# EAGLE design 3 (EAGLE 6.4)
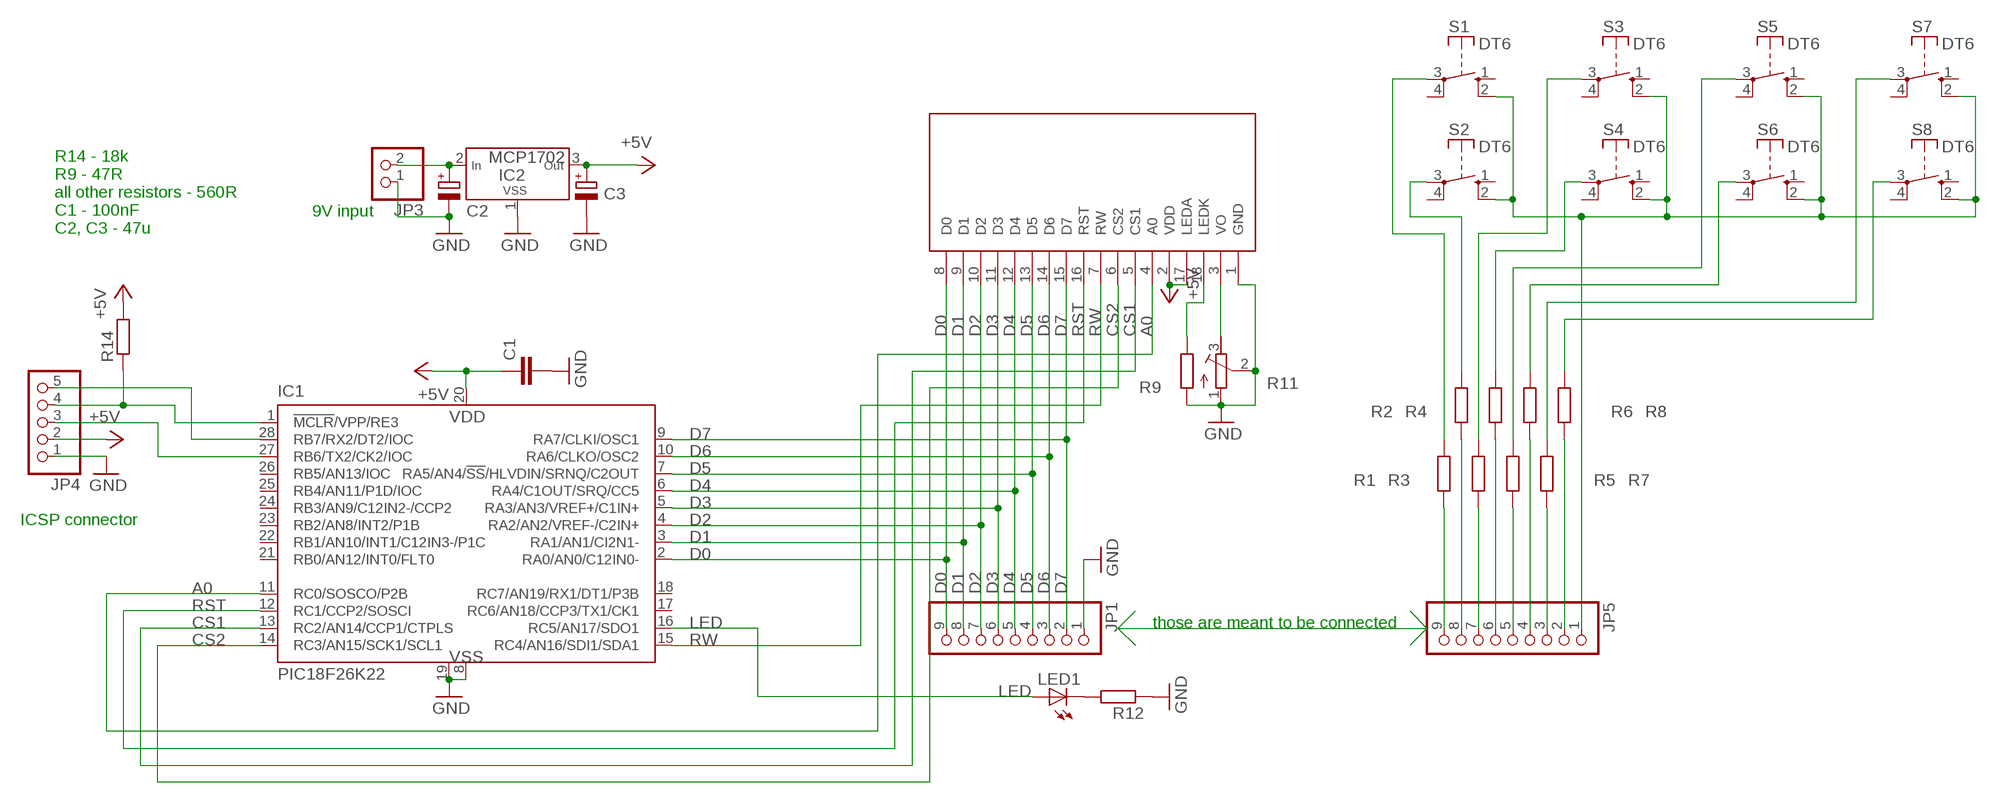
[diagram p0: schematic, sheet 1]

## Parts
C1  C-EU025-025X050  [C025-025X050]
C2  CPOL-EUE2-4  [E2-4]
C3  CPOL-EUE2-4  [E2-4]
IC1  PIC18F26K22  [DIL28-3]
IC2  MCP1702  [TO-92]
JP1  PINHD-1X09_2.54-90°  [1X09/90]
JP3  PINHD-1X2  [1X02]
JP4  PINHD-1X05_2.54-90°  [1X05/90]
JP5  PINHD-1X09_2.54-90°  [1X09/90]
LCD1  DEM122032  [DEM122032]
LED1  LED3MM  [LED3MM]
R1  R_0207  [R_0207_BIGPADS]
R2  R_0207  [R_0207_BIGPADS]
R3  R_0207  [R_0207_BIGPADS]
R4  R_0207  [R_0207_BIGPADS]
R5  R_0207  [R_0207_BIGPADS]
R6  R_0207  [R_0207_BIGPADS]
R7  R_0207  [R_0207_BIGPADS]
R8  R_0207  [R_0207_BIGPADS]
R9  R_0207  [R_0207_BIGPADS]
R11  R-TRIMM3339P  [RTRIM3339P]
R12  R_0207  [R_0207_BIGPADS]
R14  R_0207  [R_0207_BIGPADS]
S1  DT6  [DT6]
S2  DT6  [DT6]
S3  DT6  [DT6]
S4  DT6  [DT6]
S5  DT6  [DT6]
S6  DT6  [DT6]
S7  DT6  [DT6]
S8  DT6  [DT6]

## Nets
+5V: C1.1 C3.+ IC1.20(VDD) IC2.3(OUT) JP4.2 LCD1.2(VDD) LCD1.17(LEDA) R14.P$2
A0: IC1.11(RC0/SOSCO/P2B) LCD1.4(A0)
CS1: IC1.13(RC2/AN14/CCP1/CTPLS) LCD1.5(CS1)
CS2: IC1.14(RC3/AN15/SCK1/SCL1) LCD1.6(CS2)
D0: IC1.2(RA0/AN0/C12IN0-) JP1.9 LCD1.8(D0)
D1: IC1.3(RA1/AN1/CI2N1-) JP1.8 LCD1.9(D1)
D2: IC1.4(RA2/AN2/VREF-/C2IN+) JP1.7 LCD1.10(D2)
D3: IC1.5(RA3/AN3/VREF+/C1IN+) JP1.6 LCD1.11(D3)
D4: IC1.6(RA4/C1OUT/SRQ/CC5) JP1.5 LCD1.12(D4)
D5: IC1.7(RA5/AN4/!SS!/HLVDIN/SRNQ/C2OUT) JP1.4 LCD1.13(D5)
D6: IC1.10(RA6/CLKO/OSC2) JP1.3 LCD1.14(D6)
D7: IC1.9(RA7/CLKI/OSC1) JP1.2 LCD1.15(D7)
GND: C1.2 C2.- C3.- IC1.8(VSS) IC1.19(VSS) IC2.1(VSS) JP1.1 JP3.1 JP4.1 LCD1.1(GND) R9.P$1 R11.1(E) R11.2(S) R12.P$1
LED: IC1.16(RC5/AN17/SDO1) LED1.A
N$9: JP5.9 R1.P$1
N$10: JP5.8 R2.P$1
N$11: JP5.7 R3.P$1
N$12: JP5.6 R4.P$1
N$13: JP5.5 R5.P$1
N$14: JP5.4 R6.P$1
N$15: JP5.3 R7.P$1
N$16: JP5.2 R8.P$1
N$18: JP5.1 S1.2(S) S2.2(S) S3.2(S) S4.2(S) S5.2(S) S6.2(S) S7.2(S) S8.2(S)
N$19: R1.P$2 S1.3(P)
N$20: R2.P$2 S2.3(P)
N$21: R3.P$2 S3.3(P)
N$22: R4.P$2 S4.3(P)
N$23: R5.P$2 S5.3(P)
N$24: R6.P$2 S6.3(P)
N$25: R7.P$2 S7.3(P)
N$26: R8.P$2 S8.3(P)
N$36: LCD1.18(LEDK) R9.P$2
N$37: LCD1.3(VO) R11.3(A)
N$40: LED1.K(C) R12.P$2
N$44: C2.+ IC2.2(IN) JP3.2
N$47: IC1.1(!MCLR!/VPP/RE3) JP4.4 R14.P$1
N$48: IC1.28(RB7/RX2/DT2/IOC) JP4.5
N$49: IC1.27(RB6/TX2/CK2/IOC) JP4.3
RST: IC1.12(RC1/CCP2/SOSCI) LCD1.16(RST)
RW: IC1.15(RC4/AN16/SDI1/SDA1) LCD1.7(RW)
Unconnected: IC1.17(RC6/AN18/CCP3/TX1/CK1) IC1.18(RC7/AN19/RX1/DT1/P3B) IC1.21(RB0/AN12/INT0/FLT0) IC1.22(RB1/AN10/INT1/C12IN3-/P1C) IC1.23(RB2/AN8/INT2/P1B) IC1.24(RB3/AN9/C12IN2-/CCP2) IC1.25(RB4/AN11/P1D/IOC) IC1.26(RB5/AN13/IOC) S1.1(S) S1.4(P) S2.1(S) S2.4(P) S3.1(S) S3.4(P) S4.1(S) S4.4(P) S5.1(S) S5.4(P) S6.1(S) S6.4(P) S7.1(S) S7.4(P) S8.1(S) S8.4(P)

## Notes on the sheet
- 9V input
- R14 - 18k
  R9 - 47R
  all other resistors - 560R
  C1 - 100nF
  C2, C3 - 47u
- ICSP connector
- those are meant to be connected

## Library data of the parts
C1 = _rcl:C-EU: CAPACITOR, European symbol
C2 C3 = _rcl:CPOL-EU: POLARIZED CAPACITOR, European symbol
IC1 = _mcom5:PIC18F26K22
IC2 = _mcom5:MCP1702
JP1 JP5 = pinhead-2:PINHD-1X09: PIN HEADER
JP3 = pinhead:PINHD-1X2: PIN HEADER
JP4 = pinhead-2:PINHD-1X05: PIN HEADER
LCD1 = _mcom6:DEM122032
LED1 = led:LED: LED OSRAM: - CHIPLED LG R971, LG N971, LY N971, LG Q971, LY Q971, LO R971, LY R971 LH N974, LH R974 LS Q976, LO Q976, LY Q976 LO Q996 - Hyper CHIPLED LW Q18S LB Q993, LB Q99A, LB R99A - SideLED LS A670, LO A670, LY A670, LG A670, LP A670 LB A673, LV A673, LT A673, LW A673 LH A674 LY A675 LS A676, LA A676, LO A676, LY A676, LW A676 LS A679, LY A679, LG A679 - Hyper Micro SIDELED® LS Y876, LA Y876, LO Y876, LY Y876 LT Y87S - SmartLED LW L88C, LW L88S LB L89C, LB L89S, LG L890 LS L89K, LO L89K, LY L89K LS L896, LA L896, LO L896, LY L896 - TOPLED LS T670, LO T670, LY T670, LG T670, LP T670 LSG T670, LSP T670, LSY T670, LOP T670, LYG T670 LG T671, LOG T671, LSG T671 LB T673, LV T673, LT T673, LW T673 LH T674 LS T676, LA T676, LO T676, LY T676, LB T676, LH T676, LSB T676, LW T676 LB T67C, LV T67C, LT T67C, LS T67K, LO T67K, LY T67K, LW E67C LS E67B, LA E67B, LO E67B, LY E67B, LB E67C, LV E67C, LT E67C LW T67C LS T679, LY T679, LG T679 LS T770, LO T770, LY T770, LG T770, LP T770 LB T773, LV T773, LT T773, LW T773 LH T774 LS E675, LA E675, LY E675, LS T675 LS T776, LA T776, LO T776, LY T776, LB T776 LHGB T686 LT T68C, LB T68C - Hyper Mini TOPLED® LB M676 - Mini TOPLED Santana® LG M470 LS M47K, LO M47K, LY M47K Source: http://www.osram.convergy.de LUXEON: - LUMILED® LXK2-PW12-R00, LXK2-PW12-S00, LXK2-PW14-U00, LXK2-PW14-V00 LXK2-PM12-R00, LXK2-PM12-S00, LXK2-PM14-U00 LXK2-PE12-Q00, LXK2-PE12-R00, LXK2-PE12-S00, LXK2-PE14-T00, LXK2-PE14-U00 LXK2-PB12-K00, LXK2-PB12-L00, LXK2-PB12-M00, LXK2-PB14-N00, LXK2-PB14-P00, LXK2-PB14-Q00 LXK2-PR12-L00, LXK2-PR12-M00, LXK2-PR14-Q00, LXK2-PR14-R00 LXK2-PD12-Q00, LXK2-PD12-R00, LXK2-PD12-S00 LXK2-PH12-R00, LXK2-PH12-S00 LXK2-PL12-P00, LXK2-PL12-Q00, LXK2-PL12-R00 Source: www.luxeon.com KINGBRIGHT: KA-3528ASYC Source: www.kingbright.com
R1-R9 R12 R14 = _moja:R
R11 = _rcl:R-TRIMM: Trimm resistor
S1-S8 = switch-misc:DT: ITT SWITCH

## Board
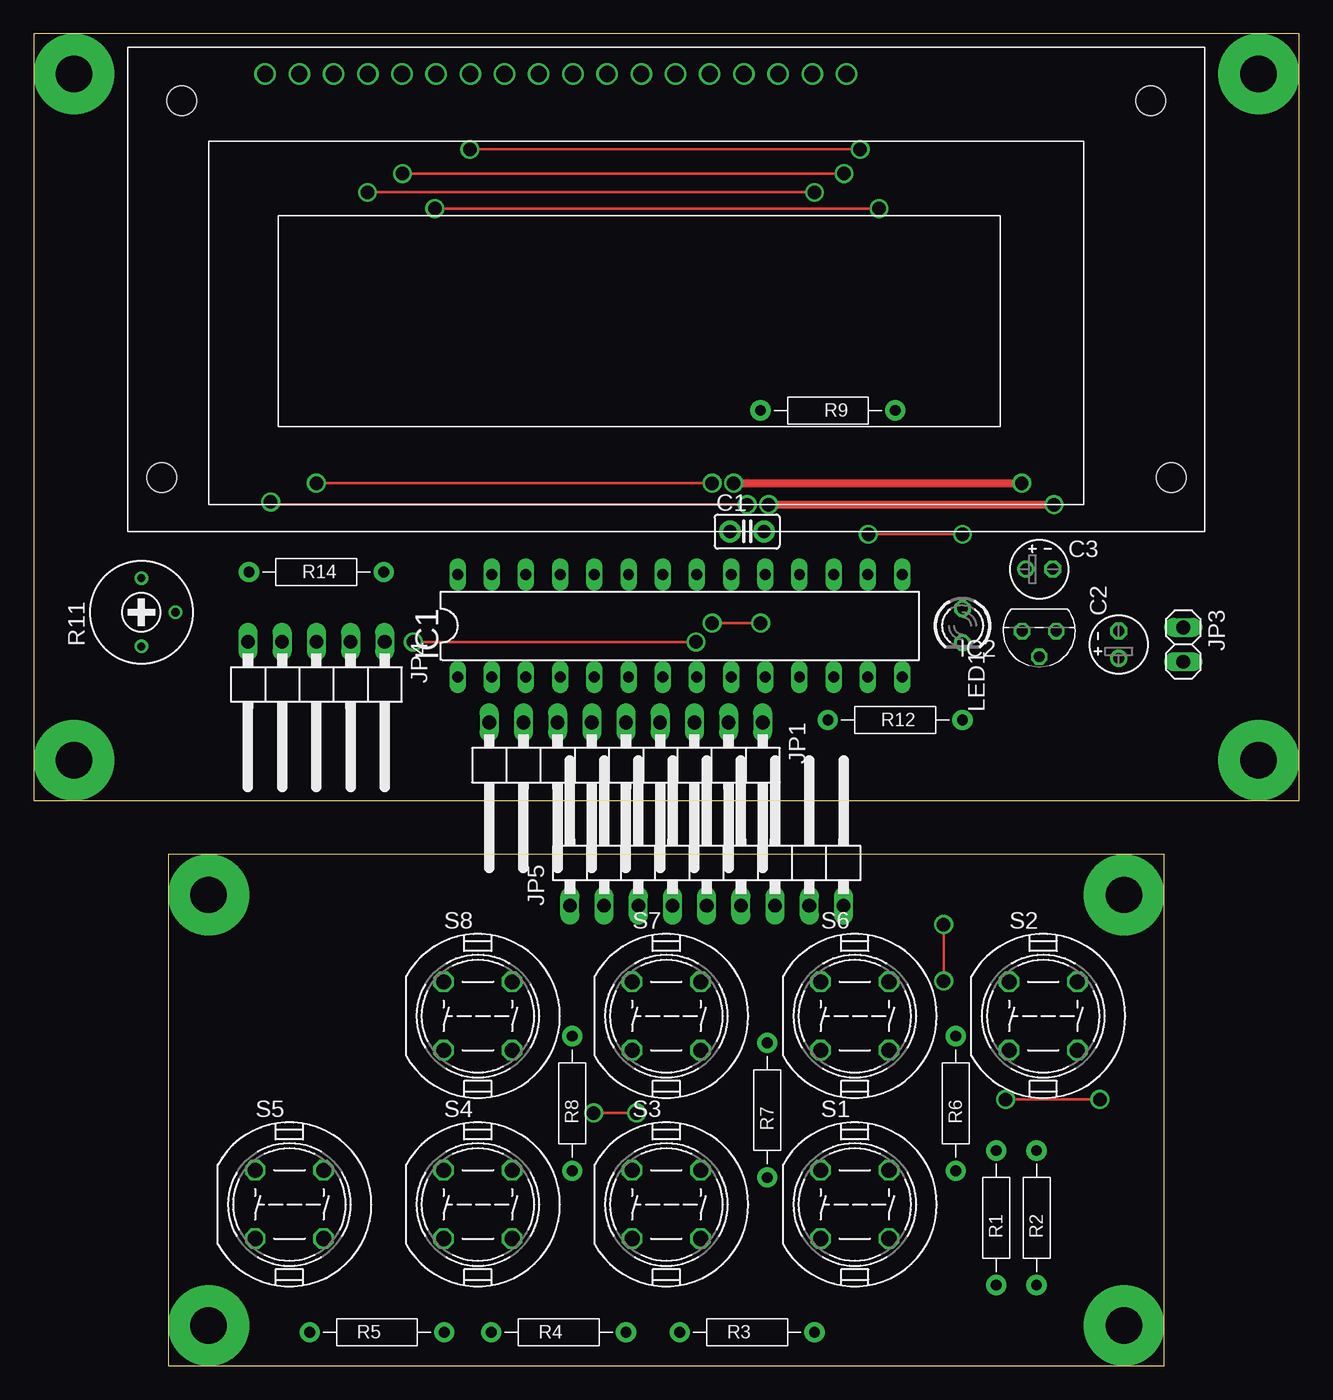
[diagram p1: board, top side]
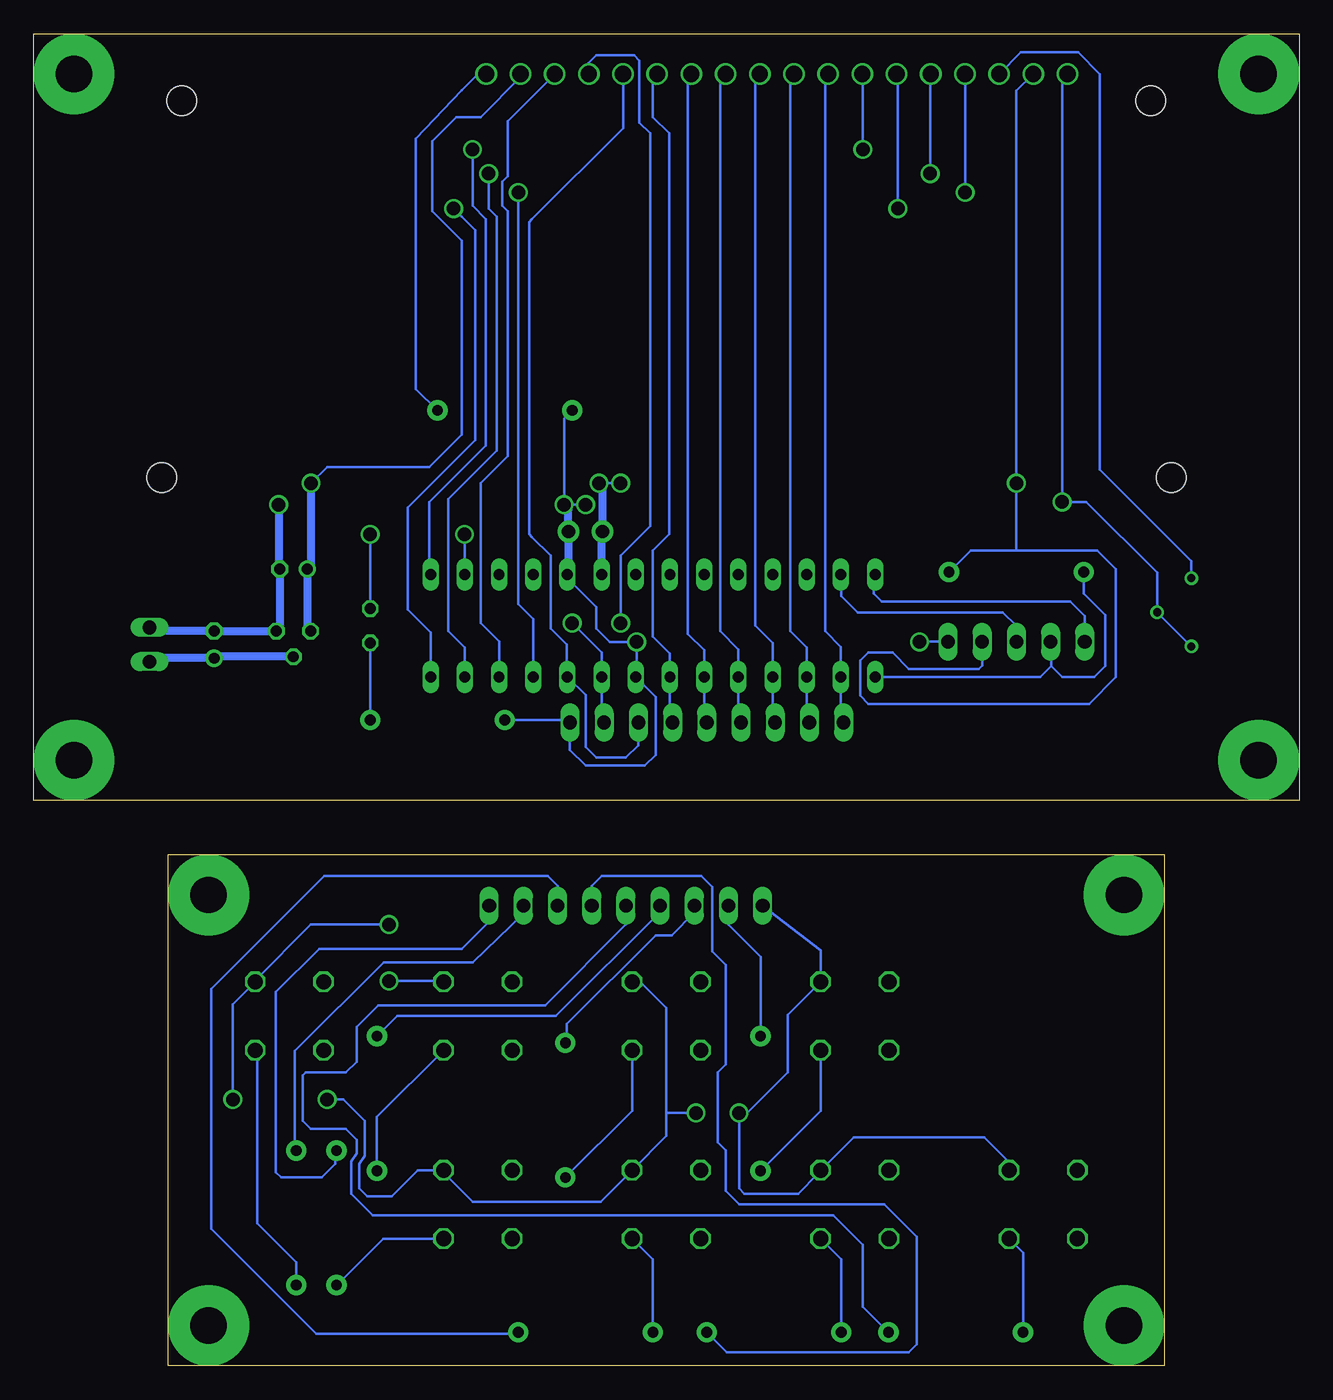
[diagram p2: board, bottom side, seen from below]

Size 94 x 99 mm. Coordinates in mm from the lower left corner, seen from the top.
Outline: 0,99 0,42 94,42 94,99 0,99
Outline: 10,38 10,0 84,0 84,38 10,38
Copper layers (1*16): Top 0.035mm / dielectric 1.5mm / Bottom 0.035mm
Design rules "ch_5": minimum track width 0.2mm, minimum drill 0.5mm, track to track 0.25mm, track to pad 0.25mm, pad to pad 0.25mm, via to via 0.25mm, smd to smd 0.25mm, copper to edge 10mil, drill to drill 8mil, minimum pad ring 0.2mm, minimum via ring 0.2mm, stop-mask expansion 4mil, vias tented up to drill 0mil, thermal gap 10mil

### Footprints (pad centres in the part's own frame; a part is rotated, then mirrored left to right if it is on the bottom)
C025-025X050 = drill 1 pad 1.6: 1 -1.27,0; 2 1.27,0
E2-4 = drill 0.813 pad 1.27: + -1.016,0 | drill 0.813 pad 1.27 octagon: - 1.016,0
DIL28-3 = drill 0.813 long: 1 -16.51,-3.81; 2 -13.97,-3.81; 3 -11.43,-3.81; 4 -8.89,-3.81; 5 -6.35,-3.81; 6 -3.81,-3.81; 7 -1.27,-3.81; 8 1.27,-3.81; 9 3.81,-3.81; 10 6.35,-3.81; 11 8.89,-3.81; 12 11.43,-3.81; 13 13.97,-3.81; 14 16.51,-3.81; 15 16.51,3.81; 16 13.97,3.81; 17 11.43,3.81; 18 8.89,3.81; 19 6.35,3.81; 20 3.81,3.81; 21 1.27,3.81; 22 -1.27,3.81; 23 -3.81,3.81; 24 -6.35,3.81; 25 -8.89,3.81; 26 -11.43,3.81; 27 -13.97,3.81; 28 -16.51,3.81
TO-92 = drill 0.813 octagon: 1 -1.27,0; 2 0,1.905; 3 1.27,0
1X09/90 = drill 1.016 long: 1 -10.16,-3.81; 2 -7.62,-3.81; 3 -5.08,-3.81; 4 -2.54,-3.81; 5 0,-3.81; 6 2.54,-3.81; 7 5.08,-3.81; 8 7.62,-3.81; 9 10.16,-3.81
1X02 = drill 1.016 long: 1 -1.27,0; 2 1.27,0
1X05/90 = drill 1.016 long: 1 -5.08,-3.81; 2 -2.54,-3.81; 3 0,-3.81; 4 2.54,-3.81; 5 5.08,-3.81
DEM122032 = drill 1.2: 1 10.2,34; 2 12.74,34; 3 15.28,34; 4 17.82,34; 5 20.36,34; 6 22.9,34; 7 25.44,34; 8 27.98,34; 9 30.52,34; 10 33.06,34; 11 35.6,34; 12 38.14,34; 13 40.68,34; 14 43.22,34; 15 45.76,34; 16 48.3,34; 17 50.84,34; 18 53.38,34 | hole 2.2: 2.5,4; 77.5,4; 4,32; 76,32
LED3MM = drill 0.813 octagon: A -1.27,0; K 1.27,0
R_0207_BIGPADS = drill 0.8 pad 1.5: P$1 5,0; P$2 -5,0
RTRIM3339P = drill 0.61: 1 -2.54,0; 2 0,-2.54; 3 2.54,0
DT6 = drill 1.118 octagon: 1 -2.54,2.54; 2 2.54,2.54; 3 2.54,-2.54; 4 -2.54,-2.54

### Placement (x,y rotation side)
C1  53,62 0 top
C2  80.6,53.6 90 top
C3  74.7,59.2 0 top
IC1  48,55 0 top
IC2  74.7,54.6 180 top
JP1  44,44 180 top
JP3  85.4,53.6 270 top
JP4  21,50 180 top
JP5  50,38 0 top
LCD1  7,62 0 top
LED1  69,55 270 top
R1  71.5,11 90 top
R2  74.5,11 90 top
R3  53,2.5 0 top
R4  39,2.5 0 top
R5  25.5,2.5 0 top
R6  68.5,19.5 90 top
R7  54.5,19 90 top
R8  40,19.5 90 top
R9  59,71 180 top
R11  8,56 90 top
R12  64,48 180 top
R14  21,59 180 top
S1  61,12 0 top
S2  75,26 0 top
S3  47,12 0 top
S4  33,12 0 top
S5  19,12 0 top
S6  61,26 0 top
S7  47,26 0 top
S8  33,26 0 top

### Tracks (layer width: path | path; a pad name or v marks a point on that pad's centre or on a via)
+5V  (via drill 1)
  Top 0.2: v50.4,65.6 v21,65.6
  Top 0.6: v52,65.6 v73.4,65.6
  Bottom 0.2: LCD1.17 57.84,95.76 60.8,92.8 62.6,92.8 64.4,91 64.4,85.8 62.2,83.6 62.2,69.2 64.6,66.8 72.2,66.8 v73.4,65.6 | v52,65.6 v50.4,65.6 | LCD1.2 21,94.74 v21,65.6 21,60.6 | JP4.2 23.54,52.06 23.8,51.8 29,51.8 30.2,53 32,53 32.6,52.4 32.6,49.8 32,49.2 15.6,49.2 13.6,51.2 13.6,59.2 15,60.6 21,60.6 | 21,60.6 24.4,60.6 R14.P$2
  Bottom 0.6: IC1.20 51.81,61.92 C1.1 51.73,65.33 v52,65.6 | v73.4,65.6 73.4,59.48 C3.+ 73.68,54.85 IC2.3
A0  (via drill 1)
  Top 0.2: v58,87.2 v24.8,87.2
  Bottom 0.2: IC1.11 56.89,55.49 58,56.6 v58,87.2 | v24.8,87.2 24.8,95.98 LCD1.4
CS1  (via drill 1)
  Top 0.2: v60.2,88.6 v27.4,88.6
  Bottom 0.2: IC1.13 61.97,53.37 63.2,54.6 63.2,64.4 59.6,68 59.6,85.4 60.2,86 v60.2,88.6 | v27.4,88.6 27.4,95.96 LCD1.5
CS2  (via drill 1)
  Top 0.2: v62.8,86 v29.8,86
  Bottom 0.2: IC1.14 64.51,54.51 66.2,56.2 66.2,63.8 61.2,68.8 61.2,84.4 62.2,85.4 v62.8,86 | v29.8,86 29.8,95.9 LCD1.6
D0
  Bottom 0.2: LCD1.8 35.2,95.78 35.2,54.6 34.03,53.43 IC1.2 34.03,48 JP1.9
D1
  Bottom 0.2: LCD1.9 37.8,95.72 37.8,54.6 36.57,53.37 IC1.3 36.57,48 JP1.8
D2
  Bottom 0.2: LCD1.10 40.4,95.66 40.4,55 39.11,53.71 IC1.4 39.11,48 JP1.7
D3
  Bottom 0.2: LCD1.11 43,95.6 43,54.6 41.65,53.25 IC1.5 41.65,48 JP1.6
D4
  Bottom 0.2: LCD1.12 45.4,95.74 45.4,54.4 44.19,53.19 IC1.6 44.19,48 JP1.5
D5
  Bottom 0.2: LCD1.13 48,95.68 48,92.8 46.8,91.6 46.8,61.8 48,60.6 48,54.2 46.73,52.93 IC1.7 46.73,48 JP1.4
D6
  Bottom 0.2: JP1.3 49.08,46.12 50,45.2 52.2,45.2 53,46 53,49.84 IC1.10 54.4,51.24 54.4,53.6 55.6,54.8 55.6,60.2 57,61.6 57.2,61.8 57.2,85 57,85.2 50.22,91.98 LCD1.14
D7  (via drill 1)
  Top 0.2: v54,55.2 v50.4,55.2
  Bottom 0.2: JP1.2 51.81,48 IC1.9 51.81,53.01 v54,55.2 | v50.4,55.2 50.4,60.2 48.2,62.4 48.2,91.6 49,92.4 49,97 49.4,97.4 52.2,97.4 52.8,96.8 52.8,96.04 LCD1.15
GND  (via drill 1)
  Top 0.2: v53,64 17.8,64 v17.6,64.2 | v28.2,53.8 v49.2,53.8
  Top 0.6: v54.6,64 v75.8,64
  Bottom 0.2: 49.27,51.8 IC1.8 47.8,49.72 47.8,45.4 48.6,44.6 53,44.6 54.16,45.76 JP1.1 54.35,48 R12.P$1 | 49.27,51.8 49.27,51.87 | IC1.19 54.4,58.76 54.4,58.6 52.2,56.4 52.2,54.8 51.2,53.8 v49.2,53.8 49.2,51.87 49.27,51.8 | R9.P$1 54.6,70.4 v54.6,64 v53,64 | LCD1.1 17.6,95.6 v17.6,64.2 15.8,64.2 10.54,58.94 R11.2 R11.1 | JP4.1 v28.19,53.81 v28.2,53.8
  Bottom 0.6: IC1.19 54.27,58.89 C1.2 54.27,63.67 v54.6,64 | v75.8,64 75.8,59.28 C3.- 75.72,54.85 IC2.1 75.99,54.62 C2.- 85.15,54.62 JP3.1
LED  (via drill 1)
  Top 0.2: v62,61.8 v69,61.8
  Bottom 0.2: IC1.16 61.97,61.77 v62,61.8 | v69,61.8 LED1.A
N$1  (via drill 2.7 pad 6)
  other vias: 3,96
N$2  (via drill 2.7 pad 6)
  other vias: 91,96
N$3  (via drill 2.7 pad 6)
  other vias: 91,45
N$4  (via drill 2.7 pad 6)
  other vias: 3,45
N$5  (via drill 2.7 pad 6)
  other vias: 13,3
N$6  (via drill 2.7 pad 6)
  other vias: 81,3
N$7  (via drill 2.7 pad 6)
  other vias: 13,35
N$8  (via drill 2.7 pad 6)
  other vias: 81,35
N$9
  Bottom 0.2: JP5.9 60.16,33.04 62.2,31 72.8,31 76,27.8 76,14.4 75.6,14 72.6,14 71.6,15 71.6,15.9 R1.P$1
N$10
  Bottom 0.2: JP5.8 57.62,33.58 61.4,30 68,30 74.6,23.4 74.6,16.1 R2.P$1
N$11
  Bottom 0.2: JP5.7 55.08,35.68 55.8,36.4 72.4,36.4 80.8,28 80.8,10.2 73,2.4 58.1,2.4 R3.P$1
N$12
  Bottom 0.2: JP5.6 52.54,35.66 51.8,36.4 44.4,36.4 43.6,35.6 43.6,30.8 42.6,29.8 42.6,22.4 43.2,21.8 43.2,16.6 42.6,16 42.6,13 41.6,12 30.8,12 28.4,9.6 28.4,1.6 29,1 42.5,1 R4.P$1
N$13
  Bottom 0.2: JP5.5 50,32.8 56,26.8 68.4,26.8 70,25.2 70,22.6 70.8,21.8 73.8,21.8 74,21.6 74,18.2 73.4,17.6 70.8,17.6 70,16.8 70,15.8 70.4,15.2 70.4,12.8 68.8,11.2 34.6,11.2 32.4,9 32.4,4.4 R5.P$1
N$14
  Bottom 0.2: JP5.4 47.46,33.74 55.2,26 67,26 R6.P$1
N$15
  Bottom 0.2: JP5.3 44.92,33.68 46.6,32 47.8,32 54.4,25.4 54.4,24.1 R7.P$1
N$16
  Bottom 0.2: JP5.2 42.38,32.78 40,30.4 R8.P$1
N$18  (via drill 1)
  Top 0.2: v67.6,32.8 v67.6,28.6 | v41.6,18.8 v44.8,18.8 | v72.2,19.8 v79.2,19.8
  Bottom 0.2: JP5.1 35.54,30.89 S8.2 38,26.08 38,21.8 41,18.8 v41.6,18.8 41.6,13.2 41.2,12.8 37.2,12.8 35.74,14.26 S4.2 33.08,17 23.4,17 21.54,15.14 S5.2 | S7.2 48.94,28.54 47,26.6 47,18.8 | 47,18.8 47,17.08 S3.2 51.88,12.2 61.4,12.2 63.54,14.34 S1.2 65.46,14.54 67.4,12.6 69.2,12.6 69.8,13.2 69.8,15 69.4,15.6 69.4,18.2 71,19.8 v72.2,19.8 | v67.6,32.8 73.4,32.8 77.54,28.66 S2.2 79.2,26.88 v79.2,19.8 | v67.6,28.6 63.6,28.6 S6.2 | v44.8,18.8 47,18.8
N$19
  Bottom 0.2: S1.3 68.04,9.46 R1.P$2
N$20
  Bottom 0.2: R2.P$2 74.5,7.7 77.4,10.6 77.4,23.32 S2.3
N$21
  Bottom 0.2: R3.P$2 48,7.92 S3.3
N$22
  Bottom 0.2: R4.P$2 34,7.92 S4.3
N$23
  Bottom 0.2: R5.P$2 20.5,8.42 S5.3
N$24
  Bottom 0.2: R6.P$2 68.5,18.5 S6.3
N$25
  Bottom 0.2: S7.3 49.54,18.96 R7.P$2
N$26
  Bottom 0.2: S8.3 35.54,18.96 R8.P$2
N$36
  Bottom 0.2: R9.P$2 65.6,72.6 65.6,91.2 62.2,94.8 60.8,96.2 60.58,96.2 LCD1.18
N$37
  Bottom 0.2: R11.3 8,59.8 14.8,66.6 14.8,96 16.4,97.6 20.68,97.6 LCD1.3
N$40
  Bottom 0.2: R12.P$2 LED1.K
N$44
  Bottom 0.6: IC2.2 80.49,52.7 C2.+ 85.15,52.58 JP3.2
N$47
  Bottom 0.2: IC1.1 19.21,51.19 18.4,52 | 18.4,52 18.4,53.75 JP4.4 | R14.P$1 16,57.4 14.4,55.8 14.4,52 15.2,51.2 17.6,51.2 18.4,52
N$48
  Bottom 0.2: JP4.5 15.92,55.72 17,56.8 31,56.8 31.6,57.4 31.6,58.7 IC1.28
N$49
  Bottom 0.2: JP4.3 21,55 22,56 32.8,56 34,57.2 34,58.78 IC1.27
RST
  Bottom 0.2: IC1.12 59.43,53.83 60.8,55.2 60.8,65.6 58.8,67.6 58.8,85.8 59.2,86.2 59.2,88 58.8,88.4 58.8,92.5 LCD1.16
RW  (via drill 1)
  Top 0.2: v61.4,90.4 v32.4,90.4
  Bottom 0.2: IC1.15 64.51,59.31 64.6,59.4 64.6,64.2 60.4,68.4 60.4,85.2 61.4,86.2 v61.4,90.4 | v32.4,90.4 32.4,95.96 LCD1.7